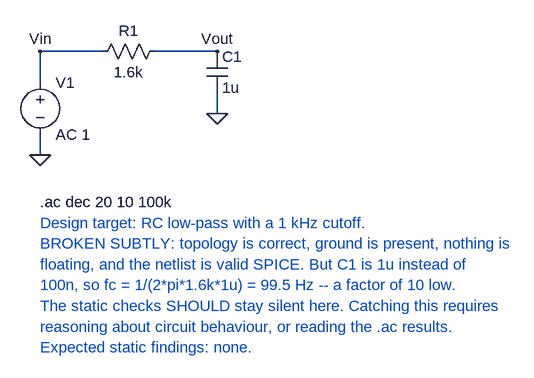
[diagram p0: schematic wrong_value_lowpass.asc]
wrong_value_lowpass.asc, the LTspice schematic file:
Version 4.1
SHEET 1 880 680
WIRE 0 -32 96 -32
WIRE 176 -32 272 -32
WIRE 0 16 0 -32
WIRE 0 128 0 96
WIRE 272 32 272 64
FLAG 0 128 0
FLAG 272 64 0
FLAG 0 -32 Vin
FLAG 272 -32 Vout
SYMBOL voltage 0 0 R0
WINDOW 123 24 124 Left 2
WINDOW 39 0 0 Left 0
SYMATTR InstName V1
SYMATTR Value AC 1
SYMBOL res 192 -48 R90
WINDOW 0 0 56 VBottom 2
WINDOW 3 32 56 VTop 2
SYMATTR InstName R1
SYMATTR Value 1.6k
SYMBOL cap 256 -32 R0
SYMATTR InstName C1
SYMATTR Value 1u
TEXT 0 200 Left 2 !.ac dec 20 10 100k
TEXT 0 232 Left 2 ;Design target: RC low-pass with a 1 kHz cutoff.
TEXT 0 264 Left 2 ;BROKEN SUBTLY: topology is correct, ground is present, nothing is
TEXT 0 296 Left 2 ;floating, and the netlist is valid SPICE. But C1 is 1u instead of
TEXT 0 328 Left 2 ;100n, so fc = 1/(2*pi*1.6k*1u) = 99.5 Hz -- a factor of 10 low.
TEXT 0 360 Left 2 ;The static checks SHOULD stay silent here. Catching this requires
TEXT 0 392 Left 2 ;reasoning about circuit behaviour, or reading the .ac results.
TEXT 0 424 Left 2 ;Expected static findings: none.

The netlist it stands for:
* wrong_value_lowpass.asc
V1 Vin 0 AC 1
R1 Vout Vin 1.6k
C1 Vout 0 1u
.ac dec 20 10 100k
* Design target: RC low-pass with a 1 kHz cutoff.
* BROKEN SUBTLY: topology is correct, ground is present, nothing is
* floating, and the netlist is valid SPICE. But C1 is 1u instead of
* 100n, so fc = 1/(2*pi*1.6k*1u) = 99.5 Hz -- a factor of 10 low.
* The static checks SHOULD stay silent here. Catching this requires
* reasoning about circuit behaviour, or reading the .ac results.
* Expected static findings: none.
.backanno
.end